# Altium schematic sheet ultrasonic_tank_monitor_power.SchDoc
size A4; SheetNumber: 2; SheetTotal: 3
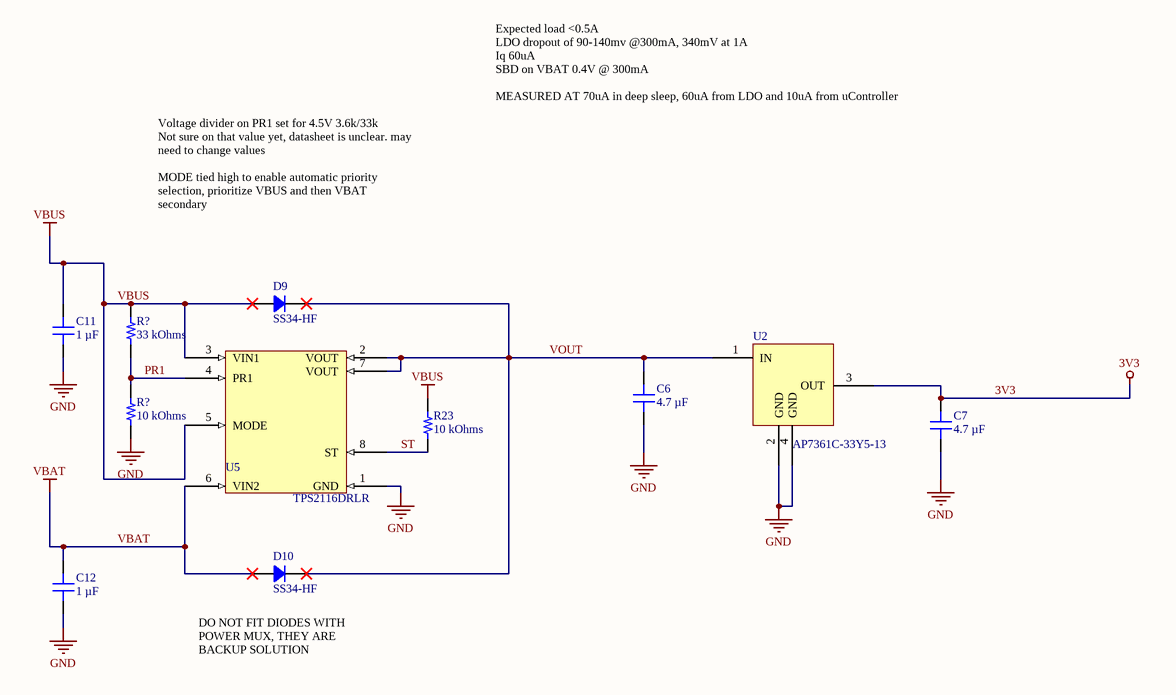
[diagram p0: ultrasonic_tank_monitor_power.SchDoc]

## Parts
(Parts that share a designator on the sheet are numbered #1, #2 ... from top to bottom, then left to right.)
C6  4.7 µF  [CAP 0603_1608]
C7  4.7 µF  [CAP 0603_1608]
C11  1 µF  [CAP 0603_1608]
C12  1 µF  [CAP 0603_1608]
D9  SS34-HF  [DO214AC SMA]
D10  SS34-HF  [DO214AC SMA]
R23  10 kOhms  [RES 0603_1608]
R?#1  33 kOhms  [RES 0603_1608]
R?#2  10 kOhms  [RES 0603_1608]
U2  AP7361C-33Y5-13  [SOT-223_L6.5-W3.5-P2.30-LS7.0-BR]
U5  TPS2116DRLR  [SOT-583-8_L2.1-W1.6-P0.50-LS1.6-BL]

## Nets
3V3: C7.2 U2.3(OUT)
GND: C6.1 C7.1 C11.1 C12.1 R?#2.1 U2.2(GND) U2.4(GND) U5.1(GND)
VBAT: C12.2 D10.1 U5.6(VIN2)
VBUS: C11.2 D9.1 R23.2 R?#1.2 U5.3(VIN1) U5.5(MODE)
PR1: R?#1.1 R?#2.2 U5.4(PR1)
ST: R23.1 U5.8(ST)
VOUT: C6.2 D9.2 D10.2 U2.1(IN) U5.2(VOUT) U5.7(VOUT)

## Notes on the sheet
- Voltage divider on PR1 set for 4.5V 3.6k/33k
  Not sure on that value yet, datasheet is unclear. may need to change values
  MODE tied high to enable automatic priority selection, prioritize VBUS and then VBAT secondary
- Expected load <0.5A
  LDO dropout of 90-140mv @300mA, 340mV at 1A
  Iq 60uA
  SBD on VBAT 0.4V @ 300mA
  MEASURED AT 70uA in deep sleep, 60uA from LDO and 10uA from uController
- (near D10) DO NOT FIT DIODES WITH POWER MUX, THEY ARE BACKUP SOLUTION

## Library data of the parts
C6 C7 = GRM188Z71C475KE21J: CAP CER 4.7UF 16V X7R 0603; manufacturer: Murata Electronics; Tolerance: ±10%; Part Number: GRM188Z71C475KE21J; Value: 4.7 µF; Applications: General Purpose; Capacitance: 4.7 µF; componentlink1description: Datasheet; componentlink1url: https://search.murata.co.jp/Ceramy/image/img/A01X/G101/ENG/GRM188Z71C475KE21-01A.pdf; componentlink2description: DigiKey Link; componentlink2url: https://www.digikey.com/en/products/detail/murata-electronics/GRM188Z71C475KE21J/16033436; Device Package: 0603 (1608 Metric); lastupdated: 15/10/2023 7:08:11 PM; Lifecycle Status: Active; Minimum Order: 1; Mounting Type: Surface Mount, MLCC; Operating Temperature: -55°C ~ 125°C; Package / Case: 0603 (1608 Metric); packaging: TapeAndReel; partid: 41988; Part Status: Active; price: 0.04; series: GRM; Size / Dimension: 0.063" L x 0.031" W (1.60mm x 0.80mm); Supplier 1: DigiKey; Supplier Part Number 1: 490-GRM188Z71C475KE21JCT-ND; Temperature Coefficient: X7R; Thickness (Max): 0.039" (1.00mm); Voltage - Rated: 16V
C11 C12 = LMK107B7105KAHT: CAP CER 1UF 10V X7R 0603; manufacturer: Taiyo Yuden; Tolerance: ±10%; Part Number: LMK107B7105KAHT; Value: 1 µF; Applications: Automotive; Capacitance: 1 µF; componentlink1description: Datasheet; componentlink1url: https://ds.yuden.co.jp/TYCOMPAS/ut/detail?pn=LMK107B7105KAHT  &u=M; componentlink2description: DigiKey Link; componentlink2url: https://www.digikey.com/en/products/detail/taiyo-yuden/LMK107B7105KAHT/4157759; Device Package: 0603 (1608 Metric); lastupdated: 17/09/2023 7:08:58 PM; Lifecycle Status: Active; Minimum Order: 1; Mounting Type: Surface Mount, MLCC; Operating Temperature: -55°C ~ 125°C; Package / Case: 0603 (1608 Metric); packaging: TapeAndReel; partid: 13032; Part Status: Active; price: 0.01; Ratings: AEC-Q200; series: M; Size / Dimension: 0.063" L x 0.031" W (1.60mm x 0.80mm); Supplier 1: DigiKey; Supplier Part Number 1: 587-3410-1-ND; Temperature Coefficient: X7R; Thickness (Max): 0.035" (0.90mm); Voltage - Rated: 10V
D9 D10 = SS34-HF: DIODE SCHOTTKY 40V 3A DO214AC; Manufacturer: Comchip Technology; Capacitance @ Vr, F: 450pF @ 4V, 1MHz; Current - Reverse Leakage @ Vr: 500 µA @ 40 V; Speed: Fast Recovery =< 500ns, > 200mA (Io); Voltage - Forward (Vf) (Max) @ If: 550 mV @ 3 A; Part Number: SS34-HF; ComponentLink1Description: Datasheet; ComponentLink1URL: http://www.comchiptech.com/admin/files/product/20190514101641.pdf; ComponentLink2Description: DigiKey Link; ComponentLink2URL: https://www.digikey.com/en/products/detail/comchip-technology/SS34-HF/10279693; Current - Average Rectified (Io): 3A; Diode Type: Schottky; LastUpdated: 7/08/2023 8:38:18 PM; Lifecycle Status: Active; Minimum Order: 1; Mounting Type: Surface Mount; Operating Temperature - Junction: -55°C ~ 125°C; Package / Case: DO-214AC, SMA; Packaging: TapeAndReel; PartId: 2138; Part Status: Active; Price: 0.07; Series: -; Supplier 1: DigiKey; Supplier Part Number 1: 641-2115-1-ND; Supplier Device Package: DO-214AC (SMA); Voltage - DC Reverse (Vr) (Max): 40 V
R23 R?#2 = CRCW060310K0JNEB: RES SMD 10K OHM 5% 1/10W 0603; Manufacturer: Vishay Dale; Power (Watts): 0.1W, 1/10W; Temperature Coefficient: ±200ppm/°C; Part Number: CRCW060310K0JNEB; Value: 10 kOhms; ComponentLink1Description: Datasheet; ComponentLink1URL: http://www.vishay.com/docs/20035/dcrcwe3.pdf; ComponentLink2Description: DigiKey Link; ComponentLink2URL: https://www.digikey.com/en/products/detail/vishay-dale/CRCW060310K0JNEB/5070677; Composition: Thick Film; Device Package: 0603 (1608 Metric); Features: Automotive AEC-Q200; Height - Seated (Max): 0.020" (0.50mm); LastUpdated: 3/06/2023 7:37:02 PM; Lifecycle Status: Active; Minimum Order: 1; Number of Terminations: 2; Operating Temperature: -55°C ~ 155°C; Package / Case: 0603 (1608 Metric); Packaging: CutTape; PartId: 56621; Part Status: Active; Price: 0.01; Ratings: AEC-Q200; Resistance: 10 kOhms; Series: CRCW; Size / Dimension: 0.063" L x 0.033" W (1.60mm x 0.85mm); Supplier 1: DigiKey; Supplier Part Number 1: 541-CRCW060310K0JNEBCT-ND; Supplier Device Package: 0603; Tolerance: ±5%
R?#1 = WR06X3302FTL: RES 33K OHM 1% 1/10W 0603; Manufacturer: Walsin Technology Corporation; Power (Watts): 0.1W, 1/10W; Temperature Coefficient: ±100ppm/°C; Part Number: WR06X3302FTL; Value: 33 kOhms; ComponentLink1Description: Datasheet; ComponentLink1URL: https://www.passivecomponent.com/wp-content/uploads/chipR/ASC_WR.pdf; ComponentLink2Description: DigiKey Link; ComponentLink2URL: https://www.digikey.com/en/products/detail/walsin-technology-corporation/WR06X3302FTL/13239167; Composition: Thick Film; Device Package: 0603 (1608 Metric); Height - Seated (Max): 0.024" (0.60mm); LastUpdated: 16/10/2023 7:33:13 PM; Lifecycle Status: Active; Minimum Order: 1; Number of Terminations: 2; Operating Temperature: -55°C ~ 155°C; Package / Case: 0603 (1608 Metric); Packaging: CutTape; PartId: 62382; Part Status: Active; Price: 0.01; Resistance: 33 kOhms; Series: WR; Size / Dimension: 0.063" L x 0.031" W (1.60mm x 0.80mm); Supplier 1: DigiKey; Supplier Part Number 1: 1292-WR06X3302FTLCT-ND; Supplier Device Package: 0603; Tolerance: ±1%
U2 = AP7361C-33Y5-13: 3V3 LDO low drop out and low Iq
U5 = TPS2116DRLR: 2 IN 1 OUT Power MUX 1.6-5.5V 2.5A low-IQ